# Altium schematic sheet PWR_TPS62824-5-6-7.SchDoc
size A3; SheetNumber: 1; SheetTotal: 1
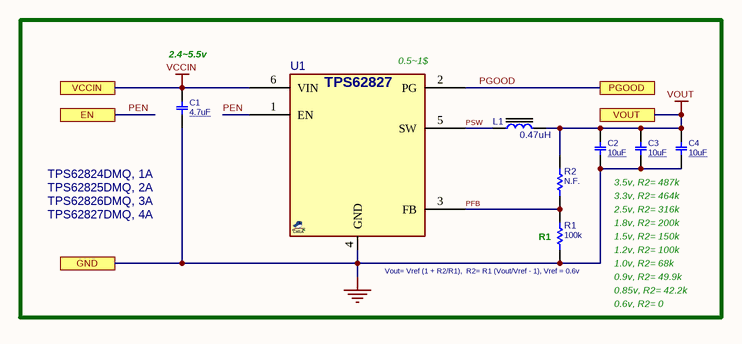
[diagram p0: PWR_TPS62824-5-6-7.SchDoc]

## Parts
C1  4.7uF  [C0402A]
C2  10uF  [C0402A]
C3  10uF  [C0402A]
C4  10uF  [C0402A]
L1  0.47uH  [L0805]
R1  100k  [R0402A]
R2  N.F.  [R0402A]
U1  TPS62827  [SONHR50_6]  (value not drawn)

## Ports
EN, GND, PGOOD, VCCIN, VOUT

## Nets
GND: C1.2 C2.2 C3.2 C4.2 R1.1 U1.4(GND) ; port GND
VCCIN: C1.1 U1.6(VIN) ; port VCCIN
VOUT: C2.1 C3.1 C4.1 L1.2 R2.2 ; port VOUT
PEN: U1.1(EN) ; port EN
PFB: R1.2 R2.1 U1.3(FB)
PGOOD: U1.2(PG) ; port PGOOD
PSW: L1.1 U1.5(SW)

## Notes on the sheet
- (near C1) 2.4~5.5v
- (near U1) 0.5~1$
- TPS62824DMQ, 1A
- 3.5v, R2= 487k
- TPS62825DMQ, 2A
- TPS62826DMQ, 3A
- TPS62827DMQ, 4A
- (near R1) R1
- 3.3v, R2= 464k
- 1.2v, R2= 100k
- 2.5v, R2= 316k
- 1.8v, R2= 200k
- 1.5v, R2= 150k
- Vout= Vref (1 + R2/R1),  R2= R1 (Vout/Vref - 1), Vref = 0.6v
- 1.0v, R2= 68k
- 0.9v, R2= 49.9k
- 0.85v, R2= 42.2k
- 0.6v, R2= 0

## Library data of the parts
C1 = CAP_SMD_MLCC: CAP, MLCC; PARAM: X5R, 20%; MANF_P#: GRM155R61A475MEAAD; PARAM2: 10v; PRICE: 100= 1$; DESC: CAP, MLCC; MANF: -; ASSEMBLY: ASSEMBLY; VALUE: 4.7uF; PACKAGE: 0402
C2-C4 = CAP_SMD_MLCC: CAP, MLCC; PARAM: X5R, 20%; MANF_P#: CL05A106MP5NUNC; PARAM2: 10v; PRICE: 100= 1$; DESC: CAP, MLCC; MANF: -; ASSEMBLY: ASSEMBLY; VALUE: 10uF; PACKAGE: 0402
L1 = INDPWR_SMD: INDUCTOR, POWER, SMD; MANF: Murata; MANF_P#: DFE201610E-R47M; PARAM2: 20%, 32mOhm; PARAM: 3.6A, -40~125oC; MANF_P#2: TFM201610GHM-R47M; PRICE: 500: $0.07; VALUE: 0.47uH
R1 R2 = RES_SMD: RESISTOR, SMD; PARAM: -W; DESC: DESCRIPTION; DIST#: MOUSER; PARAM2: 1%; MANF_P#: -; MANF: -; ASSEMBLY: ASSEMBLY; PRICE: 100= 0.5$; PACKAGE: 0402
  R1: VALUE: 100k
  R2: VALUE: N.F.
U1 = VREG_TPS62827_SONHR6: REG, Switching, Buck, 4A, ADJ, 2.2MHz, 2.4~5.5VIN, SONHR6; MANF_P#: TPS62827DMQ; MANF: Texas Instruments; PARAM: 4A, ADJ, -40~85oC; ASSEMBLY: ASSEMBLY; PARAM2: 2.2MHz, 2.4~5.5VIN; PRICE: 1.9$, 1.2$ 100pcs; VALUE: TPS62827